# EAGLE design myWatch (EAGLE 6.6.0)

## Sheet 1 of 6: MCU
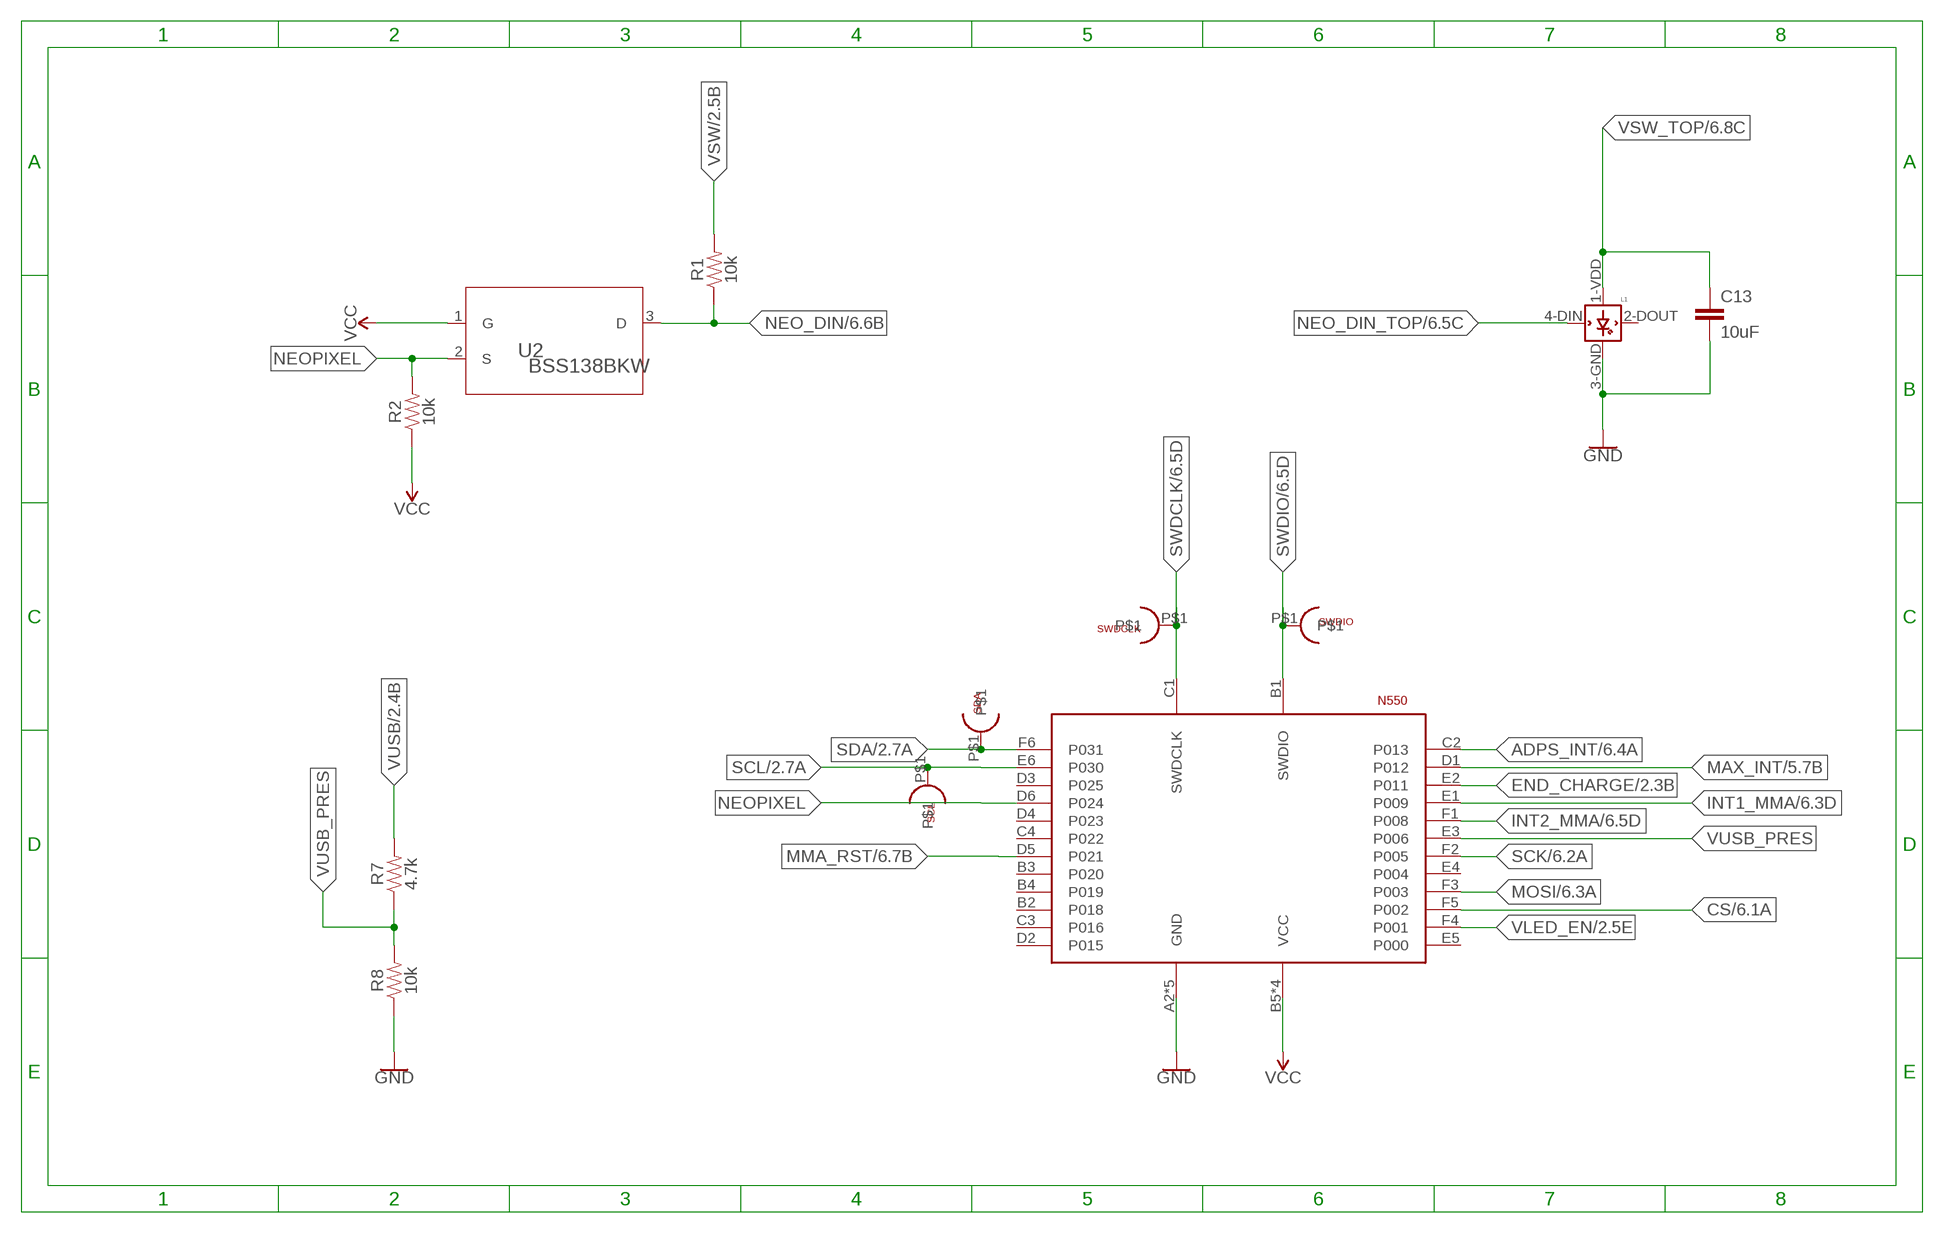
[diagram p0: schematic, sheet 1]

### Parts
C13  10uF  9.0PF-0603-50V-10%  [0603]
L1  WS2812B  [WS2812B]
R1  10k  0.05OHM-0603-1/5W-1%  [0603]
R2  10k  0.05OHM-0603-1/5W-1%  [0603]
R7  4.7k  0.05OHM-0603-1/5W-1%  [0603]
R8  10k  0.05OHM-0603-1/5W-1%  [0603]
SCL  SCL  TESTPOINT  [TESTPOINT]
SDA  SDA  TESTPOINT  [TESTPOINT]
SWDCLK  TESTPOINT  [TESTPOINT]
SWDIO  TESTPOINT  [TESTPOINT]
U2  BSS138BKW  [SOT65P210X110-3N]
U$1  N5150  [N5150]

### Nets
ADPS_INT: U$1.C2(P013) ; also sheet 6
CS: U$1.F5(P002) ; also sheet 6
END_CHARGE: U$1.E2(P011) ; also sheet 2
GND [pwr]: C13.2 L1.3-GND(GND) R8.1 U$1.A2(GND) U$1.A3(GND) U$1.A4(GND) U$1.A5(GND) U$1.A6(GND) ; also sheet 2,3,4,5,6
INT1_MMA: U$1.E1(P009) ; also sheet 6
INT2_MMA: U$1.F1(P008) ; also sheet 6
MAX_INT: U$1.D1(P012) ; also sheet 5
MMA_RST: U$1.D5(P021) ; also sheet 6
MOSI: U$1.F3(P003) ; also sheet 6
NEO_DIN: R1.1 U2.3(D) ; also sheet 6
NEO_DIN_TOP: L1.4-DIN(DIN) ; also sheet 6
NEOPIXEL: R2.2 U2.2(S) U$1.D6(P024)
SCK: U$1.F2(P005) ; also sheet 6
SCL: SCL.P$1 U$1.E6(P030) ; also sheet 2,5,6
SDA: SDA.P$1 U$1.F6(P031) ; also sheet 2,5,6
SWDCLK: SWDCLK.P$1 U$1.C1(SWDCLK) ; also sheet 6
SWDIO: SWDIO.P$1 U$1.B1(SWDIO) ; also sheet 6
VCC [pwr]: R2.1 U2.1(G) U$1.B5(VCC) U$1.B6(VCC) U$1.C5(VCC) U$1.C6(VCC) ; also sheet 2,3,4,5,6
VLED_EN: U$1.F4(P001) ; also sheet 2
VSW [pwr]: R1.2 ; also sheet 2,5,6
VSW_TOP [charge]: C13.1 L1.1-VDD(VDD) ; also sheet 6
VUSB [charge]: R7.2 ; also sheet 2
VUSB_PRES: R7.1 R8.2 U$1.E3(P006)
Unconnected: L1.2-DOUT(DOUT) U$1.B2(P018) U$1.B3(P020) U$1.B4(P019) U$1.C3(P016) U$1.C4(P022) U$1.D2(P015) U$1.D3(P025) U$1.D4(P023) U$1.E4(P004) U$1.E5(P000)

## Sheet 2 of 6: Power
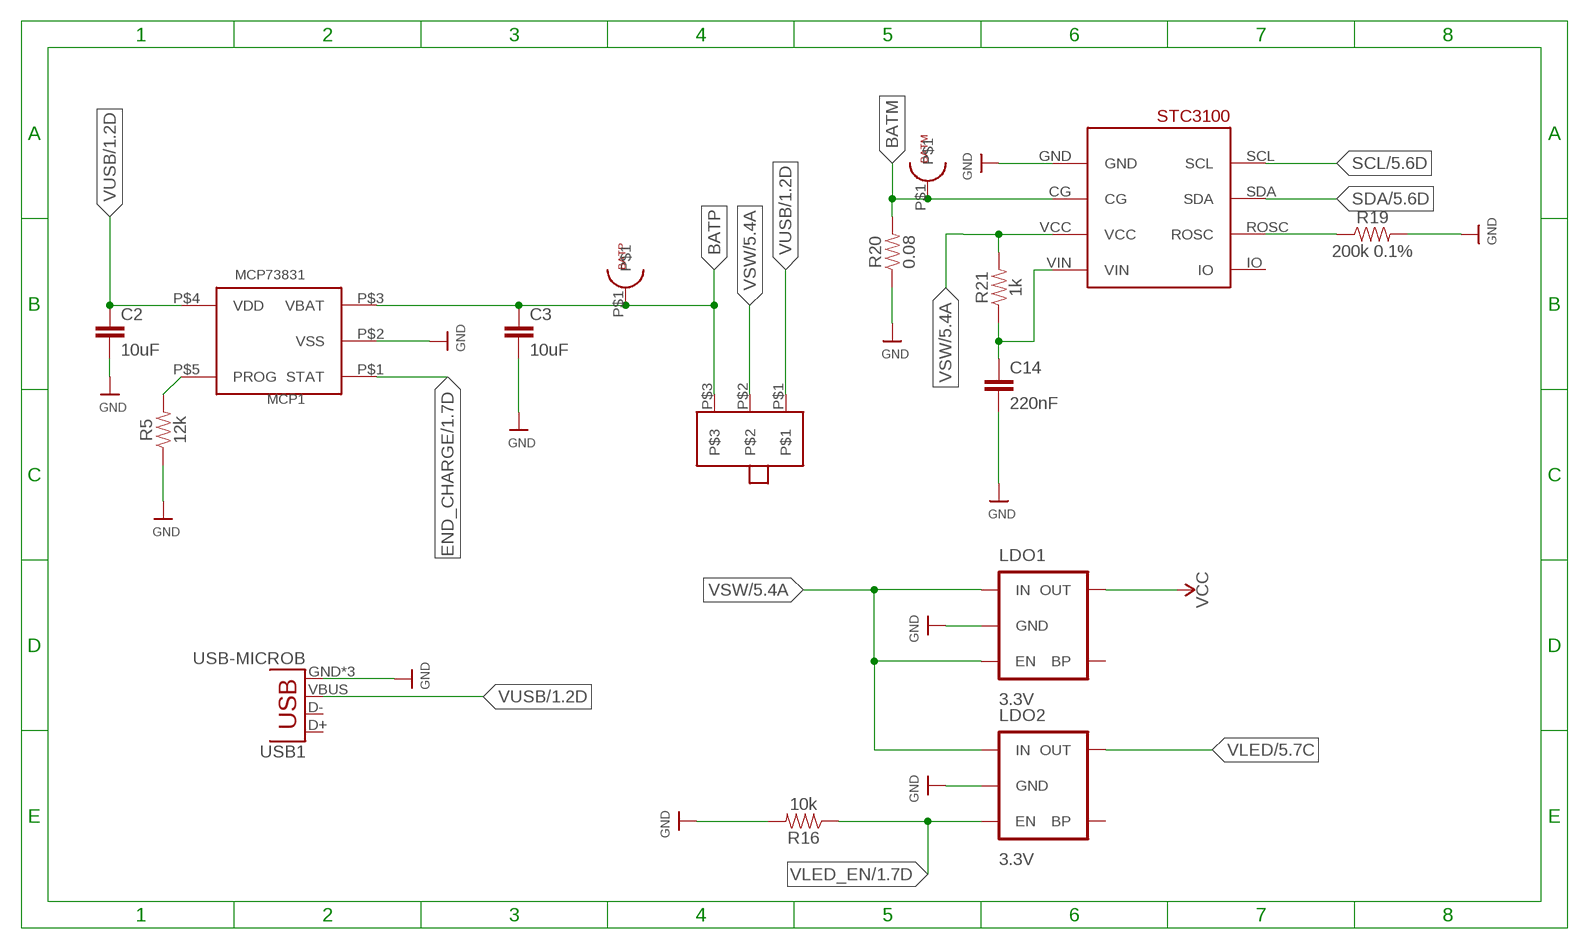
[diagram p1: schematic, sheet 2]

### Parts
BATM  BATM  TESTPOINT  [TESTPOINT]
BATP  BATP  TESTPOINT  [TESTPOINT]
C2  10uF  1.0PF-0603-50V-25%  [0603]
C3  10uF  1.0PF-0603-50V-25%  [0603]
C14  220nF  1.0PF-0603-50V-25%  [0603]
LDO1  3.3V  V_REG_MIC52053.3V  [SOT23-5]
LDO2  3.3V  V_REG_MIC52053.3V  [SOT23-5]
MCP1  MCP73831  [5PIN_SOT23]
R5  12k  0.05OHM-0603-1/5W-1%  [0603]
R16  10k  0.05OHM-0603-1/5W-1%  [0603]
R19  200k 0.1%  0.05OHM-0603-1/5W-1%  [0603]
R20  0.08  0.05OHM-0603-1/5W-1%  [0603]
R21  1k  0.05OHM-0603-1/5W-1%  [0603]
STC1  STC3100  [STC3100]
U$10  JS102011SAQN  [JS102011SAQN]
USB1  USB-MICROB  [USB-MICROB]

### Nets
BATM [charge]: BATM.P$1 R20.2 STC1.CG
BATP [charge]: BATP.P$1 C3.1 MCP1.P$3(VBAT) U$10.P$3
END_CHARGE: MCP1.P$1(STAT) ; also sheet 1
GND [pwr]: C2.2 C3.2 C14.2 LDO1.2(GND) LDO2.2(GND) MCP1.P$2(VSS) R5.1 R16.2 R19.2 R20.1 STC1.GND USB1.GND USB1.MT1(GND) USB1.MT2(GND) ; also sheet 1,3,4,5,6
N$1: MCP1.P$5(PROG) R5.2
N$11: R19.1 STC1.ROSC
N$13: C14.1 R21.1 STC1.VIN
SCL: STC1.SCL ; also sheet 1,5,6
SDA: STC1.SDA ; also sheet 1,5,6
VCC [pwr]: LDO1.5(OUT) ; also sheet 1,3,4,5,6
VLED [pwr]: LDO2.5(OUT) ; also sheet 5,6
VLED_EN: LDO2.3(EN) R16.1 ; also sheet 1
VSW [pwr]: LDO1.1(IN) LDO1.3(EN) LDO2.1(IN) R21.2 STC1.VCC U$10.P$2 ; also sheet 1,5,6
VUSB [charge]: C2.1 MCP1.P$4(VDD) U$10.P$1 USB1.VBUS ; also sheet 1
Unconnected: LDO1.4(BP) LDO2.4(BP) STC1.IO USB1.D+ USB1.D-

## Sheet 3 of 6: Acc
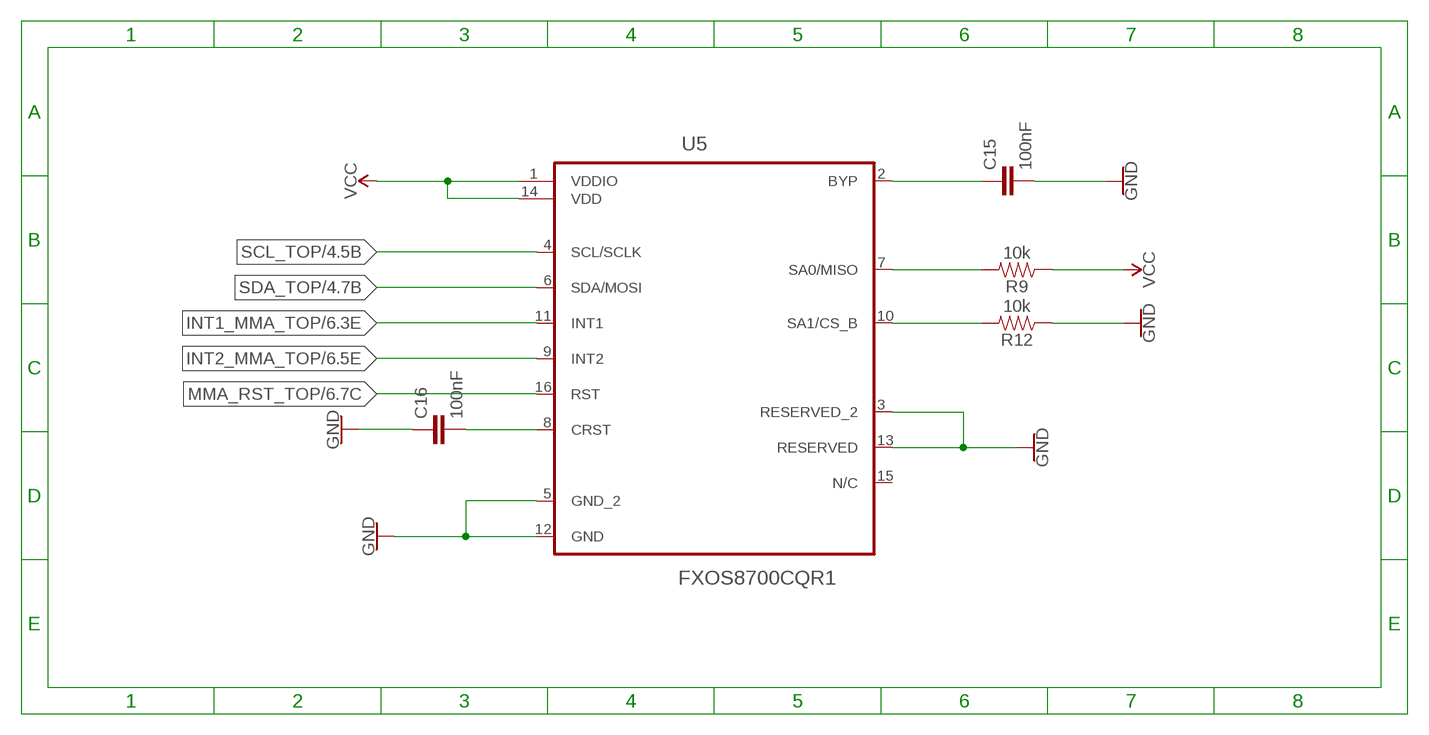
[diagram p2: schematic, sheet 3]

### Parts
C15  100nF  1.0PF-0603-50V-25%  [0603]
C16  100nF  1.0PF-0603-50V-25%  [0603]
R9  10k  0.27OHM-0603-1/10W-1%  [0603]
R12  10k  0.27OHM-0603-1/10W-1%  [0603]
U5  FXOS8700CQR1  [QFN50P300X300X120-16N]

### Nets
GND [pwr]: C15.2 C16.1 R12.1 U5.3(RESERVED_2) U5.5(GND_2) U5.12(GND) U5.13(RESERVED) ; also sheet 1,2,4,5,6
INT1_MMA_TOP: U5.11(INT1) ; also sheet 6
INT2_MMA_TOP: U5.9(INT2) ; also sheet 6
MMA_RST_TOP: U5.16(RST) ; also sheet 6
N$2: C16.2 U5.8(CRST)
N$4: R12.2 U5.10(SA1/CS_B)
N$7: R9.2 U5.7(SA0/MISO)
N$8: C15.1 U5.2(BYP)
SCL_TOP: U5.4(SCL/SCLK) ; also sheet 4,6
SDA_TOP: U5.6(SDA/MOSI) ; also sheet 4,6
VCC [pwr]: R9.1 U5.1(VDDIO) U5.14(VDD) ; also sheet 1,2,4,5,6
Unconnected: U5.15(N/C)

## Sheet 4 of 6: Periph
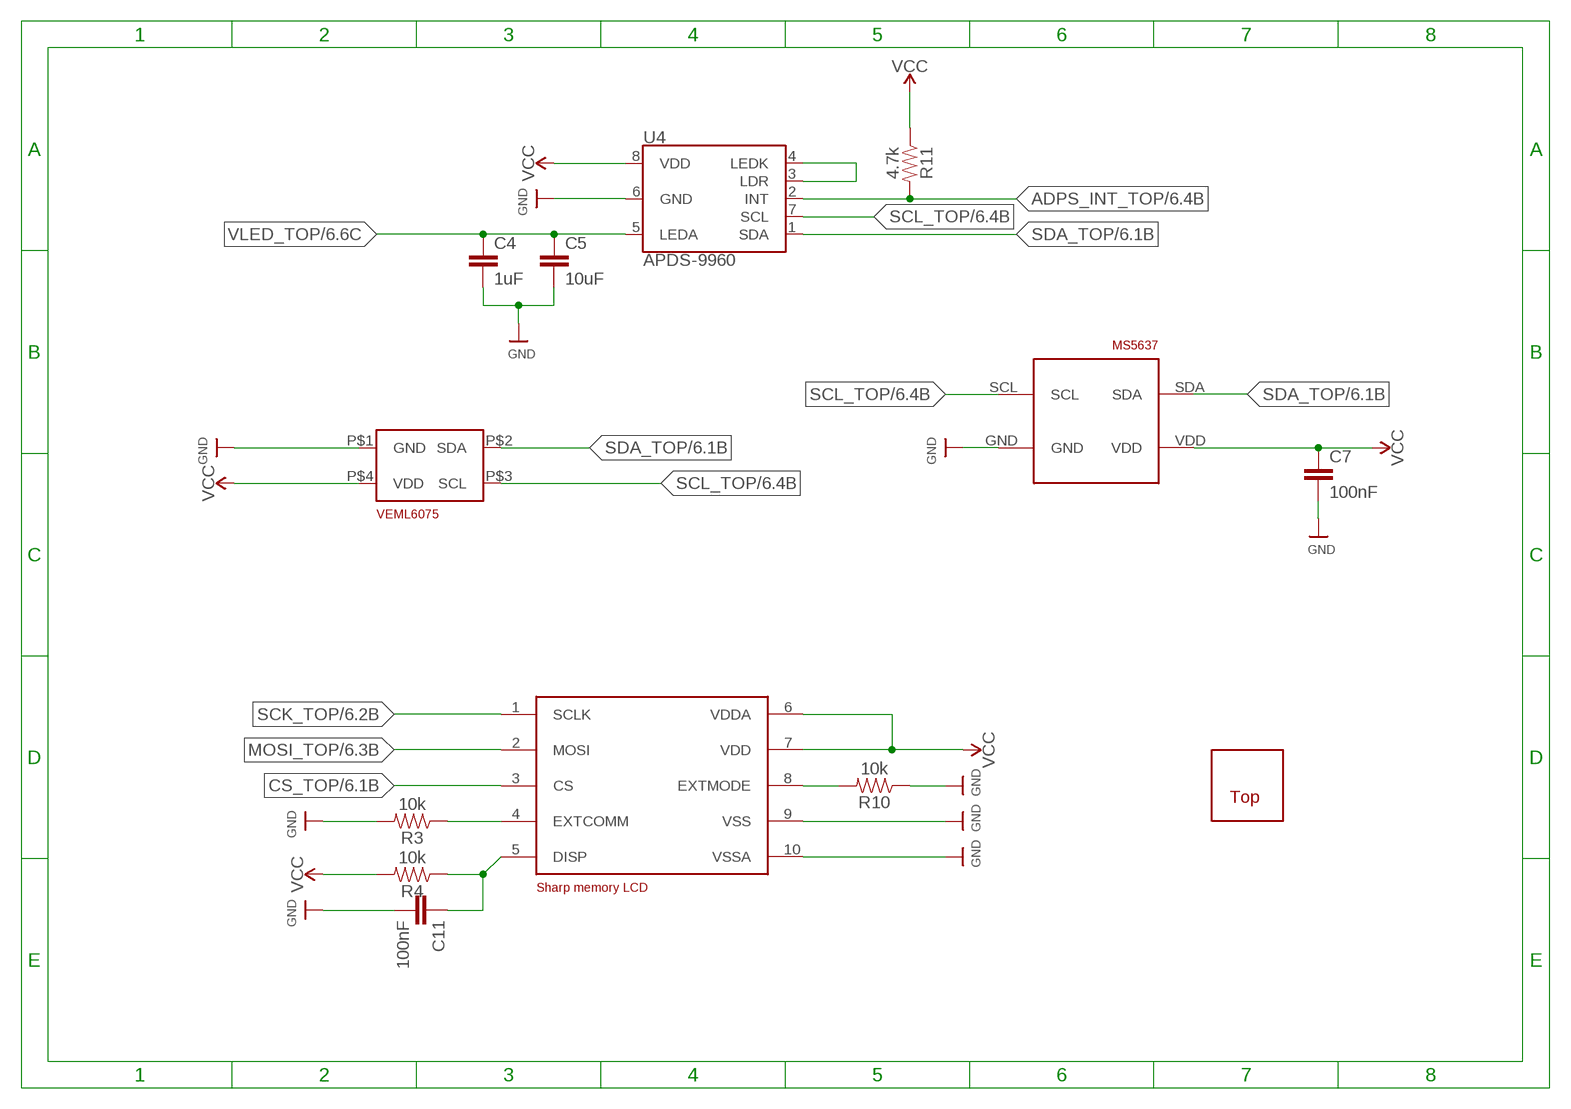
[diagram p3: schematic, sheet 4]

### Parts
C4  1uF  1.0PF-0603-50V-25%  [0603]
C5  10uF  1.0PF-0603-50V-25%  [0603]
C7  100nF  1.5PF-0603-50V-16.667%  [0603]
C11  100nF  1.5PF-0603-50V-16.667%  [0603]
MS5637  MS5637  [MS5637]
R3  10k  0.05OHM-0603-1/5W-1%  [0603]
R4  10k  0.05OHM-0603-1/5W-1%  [0603]
R10  10k  0.05OHM-0603-1/5W-1%  [0603]
R11  4.7k  0.05OHM-0603-1/5W-1%  [0603]
SHARP  SHARP27  [SHARP27]
U4  APDS-9960  [APDS-9960]
U$2  VEML6075  [VEML6075]
U$6  WATCH1  [WATCH]

### Nets
ADPS_INT_TOP: R11.2 U4.2(INT) ; also sheet 6
CS_TOP: SHARP.3(CS) ; also sheet 6
GND [pwr]: C4.2 C5.2 C7.2 C11.2 MS5637.GND R3.2 R10.1 SHARP.9(VSS) SHARP.10(VSSA) U4.6(GND) U$2.P$1(GND) ; also sheet 1,2,3,5,6
MOSI_TOP: SHARP.2(MOSI) ; also sheet 6
N$3: U4.3(LDR) U4.4(LEDK)
N$25: R10.2 SHARP.8(EXTMODE)
N$26: R3.1 SHARP.4(EXTCOMM)
N$27: C11.1 R4.1 SHARP.5(DISP)
SCK_TOP: SHARP.1(SCLK) ; also sheet 6
SCL_TOP: MS5637.SCL U4.7(SCL) U$2.P$3(SCL) ; also sheet 3,6
SDA_TOP: MS5637.SDA U4.1(SDA) U$2.P$2(SDA) ; also sheet 3,6
VCC [pwr]: C7.1 MS5637.VDD R4.2 R11.1 SHARP.6(VDDA) SHARP.7(VDD) U4.8(VDD) U$2.P$4(VDD) ; also sheet 1,2,3,5,6
VLED_TOP: C4.1 C5.1 U4.5(LEDA) ; also sheet 6

## Sheet 5 of 6: MAX30102
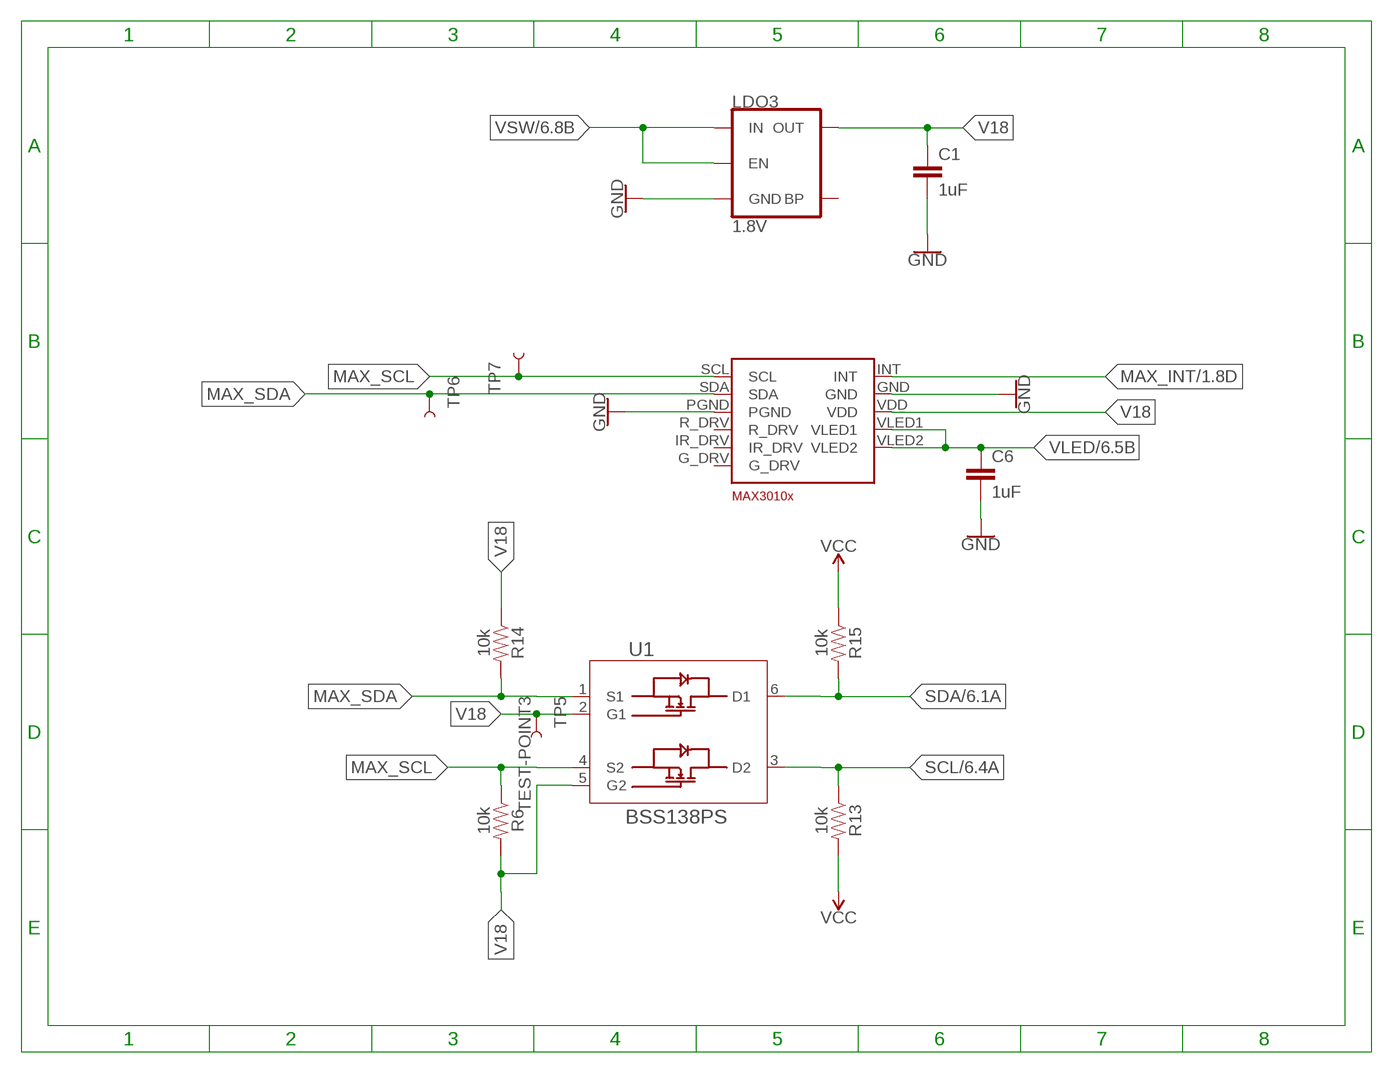
[diagram p4: schematic, sheet 5]

### Parts
C1  1uF  5.6PF-0603-50V-5%  [0603]
C6  1uF  5.6PF-0603-50V-5%  [0603]
LDO3  1.8V  V_REG_MIC5205ADJ  [SOT23-5]
R6  10k  1.2MOHM-0603-1/10W-1%  [0603]
R13  10k  1.2MOHM-0603-1/10W-1%  [0603]
R14  10k  1.2MOHM-0603-1/10W-1%  [0603]
R15  10k  1.2MOHM-0603-1/10W-1%  [0603]
TP5  TEST-POINT3  [PAD.03X.03]
TP6  TEST-POINT3  [PAD.03X.03]
TP7  TEST-POINT3  [PAD.03X.03]
U1  BSS138PS  [SOT65P210X110-6N]
U3  MAX30102  [MAX30102]

### Nets
GND [pwr]: C1.2 C6.2 LDO3.2(GND) U3.GND U3.PGND ; also sheet 1,2,3,4,6
MAX_INT: U3.INT ; also sheet 1
MAX_SCL: R6.1 TP7.P$1 U1.4(S2) U3.SCL
MAX_SDA: R14.2 TP6.P$1 U1.1(S1) U3.SDA
SCL: R13.1 U1.3(D2) ; also sheet 1,2,6
SDA: R15.2 U1.6(D1) ; also sheet 1,2,6
V18: C1.1 LDO3.5(OUT) R6.2 R14.1 TP5.P$1 U1.2(G1) U1.5(G2) U3.VDD
VCC [pwr]: R13.2 R15.1 ; also sheet 1,2,3,4,6
VLED [pwr]: C6.1 U3.VLED1 U3.VLED2 ; also sheet 2,6
VSW [pwr]: LDO3.1(IN) LDO3.3(EN) ; also sheet 1,2,6
Unconnected: LDO3.4(BP) U3.G_DRV U3.IR_DRV U3.R_DRV

## Sheet 6 of 6: Connectors
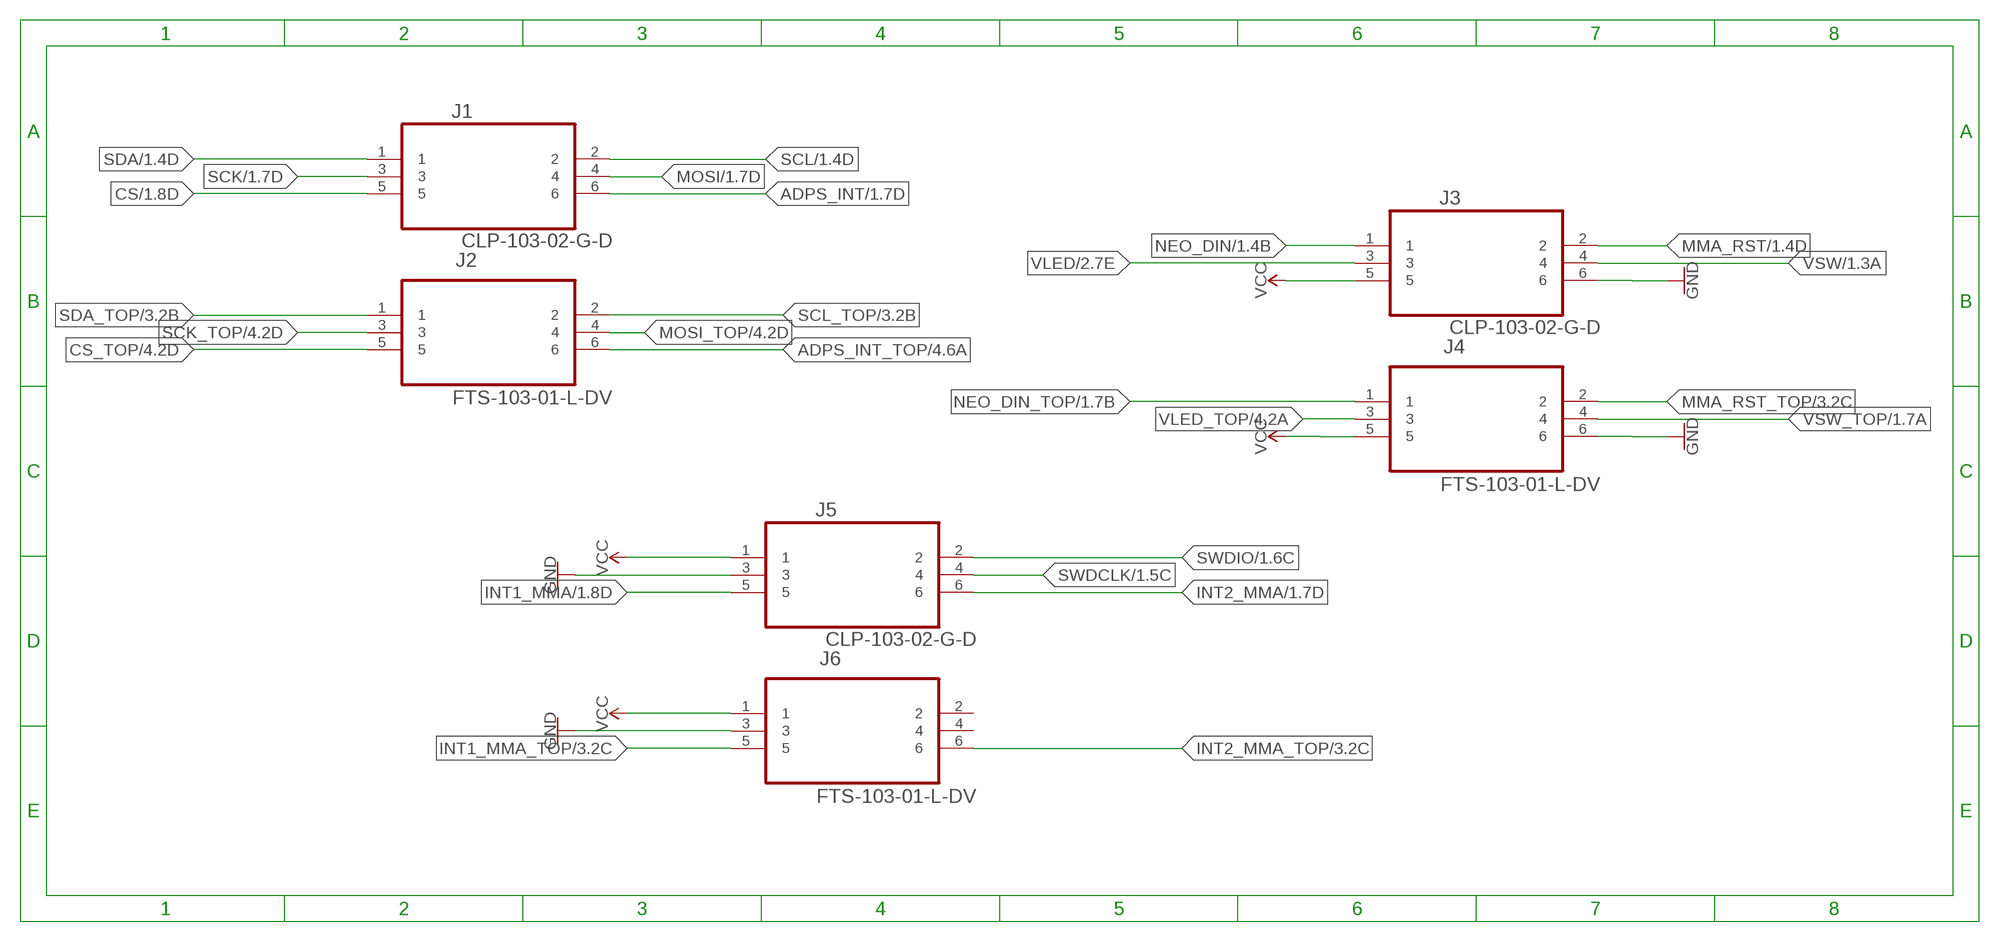
[diagram p5: schematic, sheet 6]

### Parts
J1  CLP-103-02-G-D  [SAMTEC_CLP-103-02-G-D]
J2  FTS-103-01-L-DV  [SAMTEC_FTS-103-01-L-DV]
J3  CLP-103-02-G-D  [SAMTEC_CLP-103-02-G-D]
J4  FTS-103-01-L-DV  [SAMTEC_FTS-103-01-L-DV]
J5  CLP-103-02-G-D  [SAMTEC_CLP-103-02-G-D]
J6  FTS-103-01-L-DV  [SAMTEC_FTS-103-01-L-DV]

### Nets
ADPS_INT: J1.6 ; also sheet 1
ADPS_INT_TOP: J2.6 ; also sheet 4
CS: J1.5 ; also sheet 1
CS_TOP: J2.5 ; also sheet 4
GND [pwr]: J3.6 J4.6 J5.3 J6.3 ; also sheet 1,2,3,4,5
INT1_MMA: J5.5 ; also sheet 1
INT1_MMA_TOP: J6.5 ; also sheet 3
INT2_MMA: J5.6 ; also sheet 1
INT2_MMA_TOP: J6.6 ; also sheet 3
MMA_RST: J3.2 ; also sheet 1
MMA_RST_TOP: J4.2 ; also sheet 3
MOSI: J1.4 ; also sheet 1
MOSI_TOP: J2.4 ; also sheet 4
NEO_DIN: J3.1 ; also sheet 1
NEO_DIN_TOP: J4.1 ; also sheet 1
SCK: J1.3 ; also sheet 1
SCK_TOP: J2.3 ; also sheet 4
SCL: J1.2 ; also sheet 1,2,5
SCL_TOP: J2.2 ; also sheet 3,4
SDA: J1.1 ; also sheet 1,2,5
SDA_TOP: J2.1 ; also sheet 3,4
SWDCLK: J5.4 ; also sheet 1
SWDIO: J5.2 ; also sheet 1
VCC [pwr]: J3.5 J4.5 J5.1 J6.1 ; also sheet 1,2,3,4,5
VLED [pwr]: J3.3 ; also sheet 2,5
VLED_TOP: J4.3 ; also sheet 4
VSW [pwr]: J3.4 ; also sheet 1,2,5
VSW_TOP [charge]: J4.4 ; also sheet 1
Unconnected: J6.2 J6.4

## Library data of the parts
BATM BATP SCL SDA SWDCLK SWDIO = test_points:TESTPOINT
C1 C6 = SparkFun-Capacitors:5.6PF: 5.6pF ceramic capacitors A capacitor is a passive two-terminal electrical component used to store electrical energy temporarily in an electric field.; PROD_ID: CAP-12456; VALUE: 5.6PF
C2-C5 C14-C16 = SparkFun-Capacitors:1.0PF: 1pF ceramic capacitors A capacitor is a passive two-terminal electrical component used to store electrical energy temporarily in an electric field.; PROD_ID: CAP-07879; VALUE: 1.0pF
C7 C11 = SparkFun-Capacitors:1.5PF: 1.5pF ceramic capacitors A capacitor is a passive two-terminal electrical component used to store electrical energy temporarily in an electric field.; PROD_ID: CAP-08763; VALUE: 1.5pF
C13 = SparkFun-Capacitors:9.0PF: 9.0pF ceramic capacitors A capacitor is a passive two-terminal electrical component used to store electrical energy temporarily in an electric field.; PROD_ID: CAP-09341; VALUE: 9.0pF
J1 J3 J5 = Conn_CAC:CLP-103-02-G-D: SOCKET, 1.27MM, VERTICAL THT, 6WAY; MPN: CLP-103-02-G-D; OC_FARNELL: 1929038; OC_NEWARK: 11P3802; PACKAGE: 1.27MM, VERTICAL THT, 6WAY; SUPPLIER: SAMTEC
J2 J4 J6 = Conn_CAC:FTS-103-01-L-DV; DESCRIPTION: Through Hole Post Header; MPN: FTS-103-01-L-DV; OC_FARNELL: 1928409; OC_NEWARK: 11P4645; PACKAGE: 6 WAY header; SUPPLIER: SAMTEC
L1 = adafruit:WS2812B
LDO1 LDO2 = SparkFun-PowerIC:V_REG_MIC5205: V_REG MIC5219 Standard 3.3V and 5V 150mA LDO voltage regulator in SOT-23 layout. Micrel part MIC5205. BP (by-pass) pin is used to lower output noise with 470pF cap, may be left open.; PROD_ID: VREG-00822; VALUE: 3.3V/150mA
LDO3 = SparkFun-IC-Power:V_REG_MIC5205: V_REG MIC5205 Standard 3.3V, 5V, and Adjustable 150mA LDO voltage regulator in SOT-23 layout. Micrel part MIC5205. BP (by-pass) pin is used to lower output noise with 470pF cap, may be left open. On the adjustable version BP is used to set output.; PROD_ID: VREG-12594; VALUE: ADJ
MCP1 = BaseApp:MCP73831: Digikey No:- __MCP73831T-2ACI/OTCT-ND__
MS5637 = MS5637:MS5637: Le MS563702BA03-50 est un Micro Altimètre ultra compact optimisé pour des applications d'altimètre et de baromètre dans des téléphones portables et des tablettes. La résolution d'altitude au niveau de la mer est de 13cm d'air. Le module de capteur comprend un capteur de pression haute linéarité et un CAN ΔΣ 24 bits ultra faible puissance avec des coefficients internes calibrés en usine. Il fournit une valeur numérique de pression et de température précise de 24 bits et différents modes de fonctionnement qui permettent à l'utilisateur d'optimiser la vitesse de conversion et la consommation de courant. La sortie de température à haute résolution permet la mise en œuvre d'une fonction altimètre / thermomètre sans capteur supplémentaire. Il peut être interfacé avec pratiquement tous les microcontrôleurs à interface I²C-bus. Le protocole de communication est simple, sans avoir à programmer des registres internes dans l'appareil. Faibles dimensions de 3 x 3 x 0.9mm³ pour une intégratio Module haute résolution, 13cm Capteur de pression numérique intégré (CAN ΔΣ 24 bits) Interface I²C Plage de pression étendue de 10 à 2000mbar Conversion rapide jusqu'à 0.5ms Faible consommation, 0.6µA (veille <=0.1µA à 25°C) Aucun composant externe (oscillateur interne)
R1-R5 R7 R8 R10 R11 R16 R19-R21 = SparkFun-Resistors:0.05OHM: 0.05Ω resistor A resistor is a passive two-terminal electrical component that implements electrical resistance as a circuit element. Resistors act to reduce current flow, and, at the same time, act to lower voltage levels within circuits. - Wikipedia; PROD_ID: RES-12535; VALUE: 0.05
R6 R13-R15 = SparkFun-Resistors:1.2MOHM: 1.2MΩ resistor A resistor is a passive two-terminal electrical component that implements electrical resistance as a circuit element. Resistors act to reduce current flow, and, at the same time, act to lower voltage levels within circuits. - Wikipedia; PROD_ID: RES-10055; VALUE: 1.2M
R9 R12 = SparkFun-Resistors:0.27OHM: 0.27Ω resistor A resistor is a passive two-terminal electrical component that implements electrical resistance as a circuit element. Resistors act to reduce current flow, and, at the same time, act to lower voltage levels within circuits. - Wikipedia; PROD_ID: RES-08787; VALUE: 0.27
SHARP = sharp:SHARP27: Sharp memory LCD LS027B7DH01
STC1 = STC3100:STC3100: The STC3100 monitors the critical parameters of a single-cell Li-Ion battery (voltage, temperature and current) and includes hardware functions to implement a gas gauge for battery charge monitoring, based on a programmable 12- to 14-bit A/D converter. With a typical 30 milliOhms external sense resistor, the battery current can be up to 2.5 A and the accumulator system provides a capacity up to +/-7000 mAh with a resolution of 0.2 mAh. The device is programmable through the I2C interface.
TP5-TP7 = SparkFun-Connectors:TEST-POINT: SparkFun Test Points Bare copper test points for troubleshooting or In-Circuit-Testing. These are used by our Production team for verifying production board runs using pogo-pins on test beds. SparkFun Products: SparkFun LSM9DS1 Breakout <https://www.sparkfun.com/products/13284> SparkFun PSOC <https://www.sparkfun.com/products/13714> SparkFun Load Cell Amplifier <https://www.sparkfun.com/products/13879>
U1 = BSS138:BSS138PS: Dual N-channel Trench MOSFET; MPN: BSS138PS; OC_FARNELL: 1972664; OC_NEWARK: 58T9002; PACKAGE: SOT-363-6; SUPPLIER: NXP
U2 = BSS138:BSS138BKW: N-channel Trench MOSFET; MPN: BSS138BKW; OC_FARNELL: 2053836; OC_NEWARK: 61T7488; PACKAGE: SOT-23-3; SUPPLIER: NXP
U3 = MAX30102:MAX30102: High-Sensitivity Pulse Oximeter and Heart-Rate Sensor for Wearable Health
U4 = SparkFun-Sensors:APDS-9960: Avago APDS-9960 Digital Proximity, Ambient Light, RGB, and Gesture Sensor. The APDS-9960 offers ambient light and color measuring, proximity detection, and touchless gesture sensing. It features UV and IR blocking filters, four separate diodes sensitive to different directions, and an I2C compatible interface. Datasheet <https://cdn.sparkfun.com/datasheets/Sensors/Proximity/apds9960.pdf> SparkFun Products SparkFun RGB and Gesture Sensor - APDS-9960 <https://www.sparkfun.com/products/12787> (SEN-12787); PROD_ID: SEN-12005
U5 = FXOS8700CQR1:FXOS8700CQR1: ACCELEROMETER, MEMS, 6-AXIS, DIGITAL OUTPUT,QFN-16; MPN: FXOS8700CQR1; OC_FARNELL: Unknown; OC_NEWARK: 47W8598; PACKAGE: QFN-16; SUPPLIER: FREESCALE SEMICONDUCTOR
U$1 = N5:N5150: Based on Nordic Semiconductor’s nRF51422 SoC, the N5 ANT SoC module series offers support for both ANT® and Bluetooth® low energy and enables both protocols to run concurrently, depending on the loaded protocol stack.
U$2 = VEML6075:VEML6075: The VEML6075 senses UVA and UVB light and incorporates photodiode, amplifiers, and analog / digital circuits into a single chip using a CMOS process. When the UV sensor is applied, it is able to detect UVA and UVB intensity to provide a measure of the signal strength as well as allowing for UVI measurement.
U$6 = myWatch:WATCH1
U$10 = JS102011SAQN:JS102011SAQN: Sub-Miniature Slide Switches
USB1 = SparkFun-Connectors:USB: USB Connectors USB-B-PTH is fully proven SKU : PRT-00139/CONN-08278 USB-miniB is fully proven SKU : PRT-00587 USB-A-PCB is untested. USB-A-H is throughly reviewed, but untested. Spark Fun Electronics SKU : PRT-00437 USB-B-SMT is throughly reviewed, but untested. Needs silkscreen touching up. USB-A-S has not been used/tested USB-MB-H has not been used/tested USB-MICROB has been used. CONN-09505; PROD_ID: CONN-09505

## Net classes
0 default: width 0.203 mm, drill 0.152 mm, clearance 0.152 mm
1 pwr: width 0.254 mm, drill 0.152 mm, clearance 0.152 mm to class 0, clearance 0.152 mm
2 charge: width 0.381 mm, drill 0.152 mm, clearance 0.152 mm to class 0, clearance 0.152 mm to class 1, clearance 0.152 mm
3 usb: width 0.254 mm, drill 0.33 mm, clearance 0.152 mm to class 0, clearance 0.152 mm to class 1, clearance 0.152 mm to class 2, clearance 0.152 mm

## Board
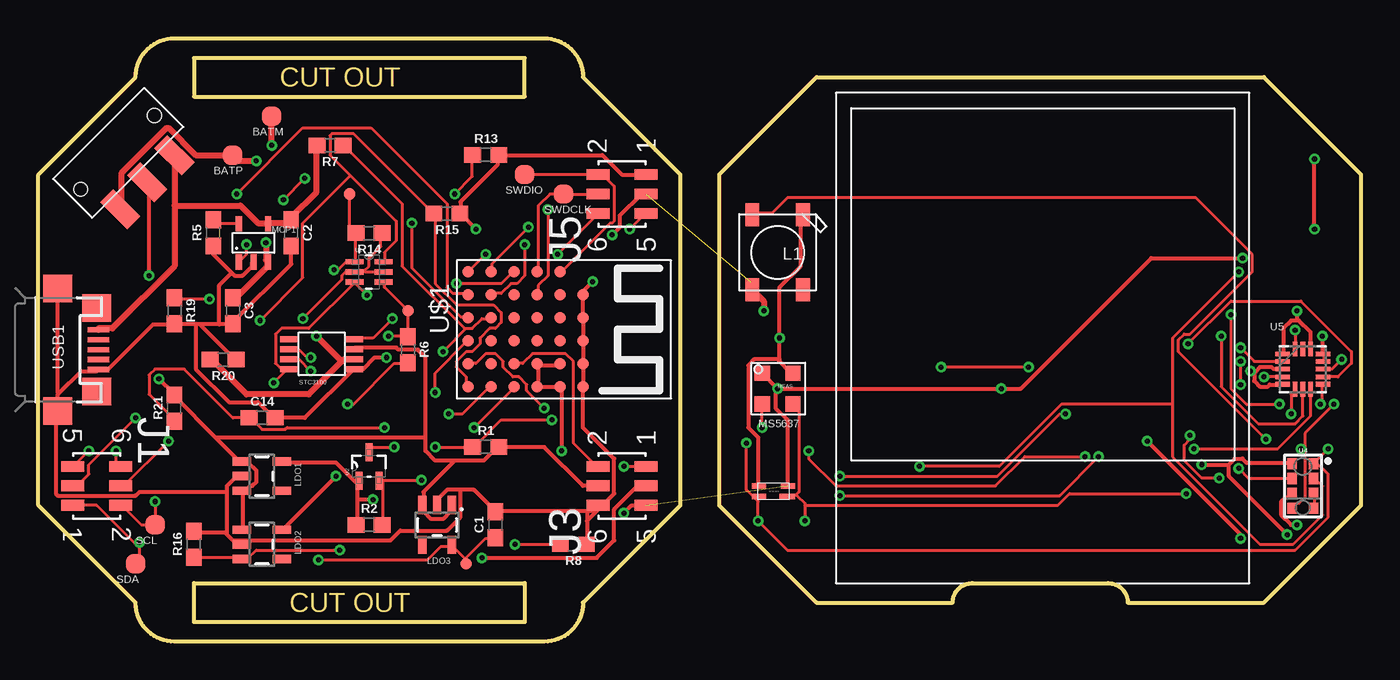
[diagram p6: board, top side]
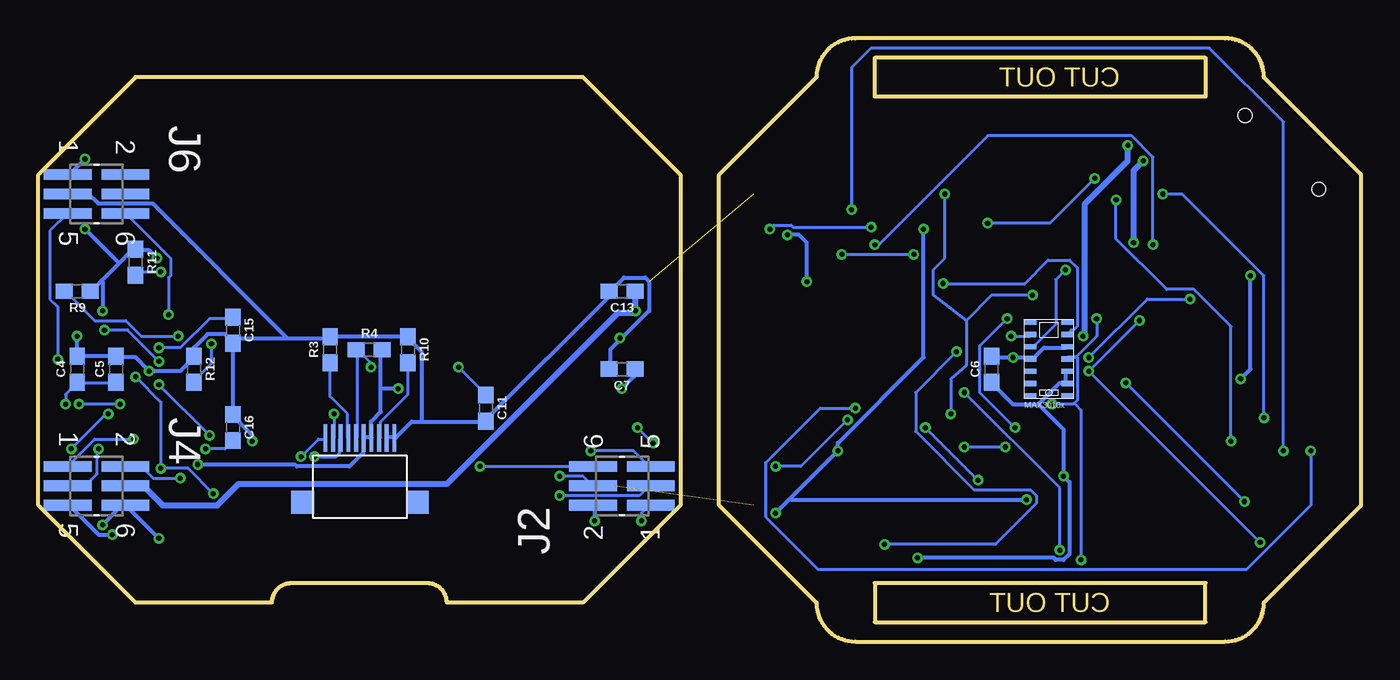
[diagram p7: board, bottom side, seen from below]

Size 86.36 x 39.37 mm. Coordinates in mm from the lower left corner, seen from the top.
Copper layers (1*16): Top 0.0356mm / dielectric 1.5011mm / Bottom 0.0356mm
Design rules "oshpark-2layer *": minimum track width 6mil, minimum drill 13mil, track to track 6mil, track to pad 6mil, pad to pad 6mil, via to via 6mil, smd to smd 6mil, copper to edge 15mil, drill to drill 6mil, minimum pad ring 7mil, minimum via ring 7mil, stop-mask expansion 2.5mil, vias tented up to drill 0mil, thermal gap 10mil

### Footprints (pad centres in the part's own frame; a part is rotated, then mirrored left to right if it is on the bottom)
TESTPOINT = smd 1.27 x 1.27: P$1 0,0
0603 = smd 1.1 x 1: 1 -0.85,0; 2 0.85,0
SAMTEC_CLP-103-02-G-D = smd 0.711 x 1.499: 1 1.27,-1.575; 2 1.27,1.575; 3 0,-1.575; 4 0,1.575; 5 -1.27,-1.575; 6 -1.27,1.575
SAMTEC_FTS-103-01-L-DV = smd 0.711 x 3.124: 1 -1.27,-1.88; 2 -1.27,1.88; 3 0,-1.88; 4 0,1.88; 5 1.27,-1.88; 6 1.27,1.88
WS2812B = smd 1.5 x 0.9: 1-VDD 2.45,-1.65; 2-DOUT 2.45,1.65; 3-GND -2.45,1.65; 4-DIN -2.45,-1.65
SOT23-5 = smd 0.55 x 1.2: 1 -0.95,-1.3; 2 0,-1.3; 3 0.95,-1.3; 4 0.95,1.3; 5 -0.95,1.3
5PIN_SOT23 = smd 0.4 x 1: P$1 0.4,-0.63; P$2 1.35,-0.63; P$3 2.3,-0.63; P$4 2.3,1.87; P$5 0.4,1.87
MS5637 = smd 1 x 1: GND 1,1; SCL 1,-1; SDA -1,-1; VDD -1,1
SHARP27 = smd 1.8 x 0.25: 1 -3.12,-2.21; 2 -3.12,-1.71; 3 -3.12,-1.21; 4 -3.12,-0.71; 5 -3.12,-0.21; 6 -3.12,0.29; 7 -3.12,0.79; 8 -3.12,1.29; 9 -3.12,1.79; 10 -3.12,2.29 | smd 1.5 x 1.5: P$8 1.06,3.79; P$9 1.06,-3.71
STC3100 = smd 1.213 x 0.406: CG 4.1,0.65; GND 4.1,0; IO -0.1,1.95; ROSC -0.1,1.3; SCL -0.1,0; SDA -0.1,0.65; VCC 4.1,1.3; VIN 4.1,1.95
PAD.03X.03 = smd 0.762 x 0.762: P$1 0,0
SOT65P210X110-6N = smd 1.168 x 0.356: 1 -0.94,0.66; 2 -0.94,0; 3 -0.94,-0.66; 4 0.94,-0.66; 5 0.94,0; 6 0.94,0.66
SOT65P210X110-3N = smd 1.168 x 0.457: 1 -0.94,0.66; 2 -0.94,-0.66; 3 0.94,0
MAX30102 = smd 0.75 x 0.35: G_DRV 0,0.8; GND 2.4,4; INT 2.4,4.8; IR_DRV 0,1.6; P$8 0,5.6; P$10 2.4,0.8; P$16 2.4,5.6; PGND 0,3.2; R_DRV 0,2.4; SCL 0,4.8; SDA 0,4; VDD 2.4,3.2; VLED1 2.4,2.4; VLED2 2.4,1.6
APDS-9960 = smd 0.6 x 0.72: 1 0.7,1.455; 2 0.7,0.485; 3 0.7,-0.485; 4 0.7,-1.455; 5 -0.7,-1.455; 6 -0.7,-0.485; 7 -0.7,0.485; 8 -0.7,1.455
QFN50P300X300X120-16N = smd 0.965 x 0.305: 1 -1.321,0.991; 2 -1.321,0.508; 3 -1.321,0; 4 -1.321,-0.508; 5 -1.321,-0.991; 9 1.321,-0.991; 10 1.321,-0.508; 11 1.321,0; 12 1.321,0.508; 13 1.321,0.991 | smd 0.305 x 0.965: 6 -0.508,-1.321; 7 0,-1.321; 8 0.508,-1.321; 14 0.508,1.321; 15 0,1.321; 16 -0.508,1.321
N5150 = smd 0.762 x 0.762 bottom: A2 -1.5,0; A3 -3,0; A4 -4.5,0; A5 -6,0; A6 -7.5,0; B1 0,-1.5; B2 -1.5,-1.5; B3 -3,-1.5; B4 -4.5,-1.5; B5 -6,-1.5; B6 -7.5,-1.5; C1 0,-3; C2 -1.5,-3; C3 -3,-3; C4 -4.5,-3; C5 -6,-3; C6 -7.5,-3; D1 0,-4.5; D2 -1.5,-4.5; D3 -3,-4.5; D4 -4.5,-4.5; D5 -6,-4.5; D6 -7.5,-4.5; E1 0,-6; E2 -1.5,-6; E3 -3,-6; E4 -4.5,-6; E5 -6,-6; E6 -7.5,-6; F1 0,-7.5; F2 -1.5,-7.5; F3 -3,-7.5; F4 -4.5,-7.5; F5 -6,-7.5; F6 -7.5,-7.5
VEML6075 = smd 0.9 x 0.35: P$1 0.05,0; P$2 0.05,-0.7; P$4 1.95,0 | smd 1 x 0.35: P$3 1.9,-0.7
JS102011SAQN = smd 1.2 x 2.5: P$1 0,0; P$2 2.5,0; P$3 5,0 | hole 0.9: -0.9,-2.75; 5.9,-2.75
USB-MICROB = smd 0.35 x 1.4: D+ 0,2.65; D- -0.65,2.65; GND 1.3,2.65; ID 0.65,2.65; VBUS -1.3,2.65 | smd 1.8 x 1.9: MT1 -4,0; MT2 4,0; MT3 -2.73,2.54; MT4 2.73,2.54

### Placement (x,y rotation side)
BATM  15.24,34.29 0 top
BATP  12.7,31.75 0 top
C1  29.84,7.62 90 top
C2  16.51,26.67 270 top
C3  12.7,21.59 270 top
C4  83.82,17.78 90 bottom
C5  81.28,17.78 90 bottom
C6  24.13,17.78 90 bottom
C7  48.26,17.78 180 bottom
C11  57.15,15.24 270 bottom
C13  48.26,22.86 180 bottom
C14  14.61,14.61 0 top
C15  73.66,20.32 270 bottom
C16  73.66,13.97 270 bottom
J1  3.81,10.16 270 top
J2  48.26,10.16 90 bottom
J3  38.1,10.16 90 top
J4  82.55,10.16 270 bottom
J5  38.1,29.21 90 top
J6  82.55,29.21 270 bottom
L1  48.26,25.4 270 top
LDO1  14.61,10.8 270 top
LDO2  14.61,6.35 270 top
LDO3  26.04,7.62 180 top
MCP1  12.7,25.4 0 top
MS5637  48.26,16.51 0 top
R1  29.21,12.7 0 top
R2  21.59,7.62 0 top
R3  67.31,19.05 90 bottom
R4  64.77,19.05 0 bottom
R5  11.43,26.67 90 top
R6  24.13,19.05 270 top
R7  19.05,32.38 180 top
R8  34.92,6.35 180 top
R9  83.82,22.86 180 bottom
R10  62.23,19.05 270 bottom
R11  80.01,24.77 270 bottom
R12  76.2,17.78 270 bottom
R13  29.21,31.75 0 top
R14  21.59,26.67 180 top
R15  26.67,27.94 180 top
R16  10.16,6.35 90 top
R19  8.89,21.59 270 top
R20  12.07,18.41 180 top
R21  8.89,15.24 90 top
SCL  7.62,7.62 0 top
SDA  6.35,5.08 0 top
SHARP  65.41,10.16 270 bottom
STC1  16.51,17.78 0 top
SWDCLK  34.29,29.21 0 top
SWDIO  31.75,30.48 0 top
TP5  27.94,5.08 0 top
TP6  20.32,29.21 0 top
TP7  24.13,21.59 0 top
U1  21.59,24.13 0 top
U2  21.59,11.43 90 top
U3  21.59,15.24 0 bottom
U4  82.55,10.16 0 top
U5  82.55,17.78 0 top
U$1  35.56,24.13 90 bottom
U$2  46.99,10.16 0 top
U$6  50.8,3.81 0 top
U$10  8.89,31.75 225 top
USB1  1.27,19.05 270 top

### Tracks (layer width: path | path; a pad name or v marks a point on that pad's centre or on a via)
ADPS_INT  (via drill 0.33)
  Top 0.203: v33.27,28.19 33.27,23.88 32.64,23.24 32.64,22.73 U$1.C2 | v5.08,12.45 5.08,11.68 5.33,11.43 J1.6
  Bottom 0.203: v33.27,28.19 33.27,37.46 32,38.73 9.91,38.73 5.08,33.91 v5.08,12.45
ADPS_INT_TOP  (via drill 0.33)
  Top 0.203: 74.04,15.49 74.04,19.81 v78.36,24.13 | 74.04,15.49 74.04,12.07 79.76,6.35 81.91,6.35 83.82,8.25 83.82,10.16 83.44,10.54 83.31,10.54 U4.2 | v57.53,11.43 62.74,11.43 66.8,15.49 74.04,15.49
  Bottom 0.203: v78.36,24.13 79.88,24.13 80.01,24 R11.2 | v57.53,11.43 50.16,11.43 J2.6
BATM  (via drill 0.33)
  Top 0.381: 19.81,18.29 19.94,18.41 20.57,18.41 STC1.CG | 19.81,18.29 17.65,16.13 13.59,16.13 11.3,18.41 R20.2 | v15.24,32.38 BATM.P$1 | v18.16,19.94 19.68,18.41 19.81,18.29
  Bottom 0.381: v15.24,32.38 15.24,31.37 18.03,28.57 18.03,20.07 v18.16,19.94
BATP  (via drill 0.33)
  Top 0.381: C3.1 12.7,22.48 12.95,22.48 14.99,24.51 14.99,24.77 MCP1.P$3 14.86,24.89 v14.86,26.04 | U$10.P$3 5.46,28.32 5.46,30.61 8.38,33.53 8.51,33.53 10.29,31.75 BATP.P$1 12.83,31.62 13.08,31.37 v14.22,31.37
  Bottom 0.381: v14.86,26.04 14.86,30.73 v14.22,31.37
CS  (via drill 0.33)
  Top 0.203: v33.02,15.24 31.88,16.38 31.88,16.76 31.37,17.27 30.99,17.27 30.35,17.91 30.35,18.29 29.84,18.8 29.21,18.8 28.57,18.16 28.07,18.16 U$1.F5 | v3.3,12.45 2.29,11.43 J1.5
  Bottom 0.203: v33.02,15.24 35.31,15.24 38.86,11.68 38.86,8.13 35.43,4.7 7.49,4.7 3.3,8.89 v3.3,12.45
CS_TOP  (via drill 0.33)
  Top 0.203: v68.33,12.07 64.39,12.07 62.48,10.16 52.07,10.16 50.29,11.94 v50.29,12.45
  Bottom 0.203: v68.33,12.07 66.93,12.07 66.67,12.32 66.67,13.21 SHARP.3 | v50.29,12.45 47.5,12.45 46.48,11.43 J2.5
END_CHARGE  (via drill 0.33)
  Top 0.203: v31.75,25.91 31.75,23.88 31.24,23.37 30.86,23.37 30.23,22.73 29.59,22.73 U$1.E2 | v13.59,25.91 13.59,25.27 13.21,24.89 MCP1.P$1
  Bottom 0.203: v31.75,25.91 31.5,25.91 24.38,33.02 14.99,33.02 13.59,31.62 v13.59,25.91
GND  (via drill 0.33)  (1 unrouted)
  Top 0.254: 35.81,8.51 36.07,8.51 36.45,8.89 J3.6 | 35.81,8.51 29.84,8.51 | 29.84,8.51 C1.2 29.84,8.51 | 35.81,8.51 35.81,7.87 | 35.81,7.87 35.81,6.35 R8.1 | 27.56,9.91 28.45,9.91 29.84,8.51 | 27.56,9.91 26.67,9.91 26.04,9.27 26.04,9.02 LDO3.2 | v22.73,18.54 21.97,18.54 21.21,17.78 20.7,17.78 STC1.GND 20.57,17.78 17.4,14.61 15.49,14.61 C14.2 15.37,14.61 14.35,15.62 12.45,15.62 10.29,17.78 10.29,20.7 | 12.64,24.07 11.43,25.27 11.43,25.78 R5.1 | 12.64,24.07 12.83,23.88 13.34,23.88 13.97,24.51 13.97,24.77 MCP1.P$2 | 11.81,20.7 12.7,20.7 C3.2 12.7,20.83 16.51,24.64 16.51,25.78 C2.2 | 11.81,20.7 10.54,20.7 | 10.54,20.7 10.29,20.7 | 10.29,20.7 8.89,20.7 | 8.89,20.7 R19.2 8.89,20.7 | 10.54,20.7 12.83,18.41 R20.1 | 11.81,20.7 11.81,23.24 12.57,24 12.64,24.07 | 12.26,7.05 12.95,6.35 13.21,6.35 LDO2.2 12.83,6.6 22.99,6.6 23.62,7.24 26.67,7.24 27.56,8.13 27.56,9.91 | 12.26,7.05 12.19,7.11 10.16,7.11 R16.2 | 12.32,9.78 12.32,7.11 12.26,7.05 | 12.32,9.78 12.32,10.16 12.95,10.8 13.21,10.8 LDO1.2 | 1.33,16.19 1.27,16.13 1.27,15.11 USB1.MT2 1.27,14.99 1.14,14.86 1.14,9.65 1.27,9.53 6.35,9.53 6.6,9.78 12.32,9.78 | 1.33,16.19 2.79,17.65 3.81,17.65 USB1.GND 3.94,17.78 4.57,17.78 7.49,20.7 8.89,20.7 | USB1.MT1 1.27,22.99 1.27,16.26 1.33,16.19 | 48.32,18.35 49.15,17.53 MS5637.GND | 48.32,18.35 48.26,18.41 46.74,18.41 46.35,18.03 46.35,13.97 46.99,13.34 46.99,10.16 U$2.P$1 | L1.3-GND 49.78,27.81 49.78,24.51 48.39,23.11 v48.39,19.81 48.39,18.41 48.32,18.35 | v82.17,7.62 81.79,7.62 81.15,8.25 81.15,9.14 81.41,9.4 81.53,9.4 81.79,9.65 U4.6 | U5.12 83.95,18.29 83.95,18.67 U5.13 83.82,18.8 v83.82,19.94
  Top 0.254: 79.44,17.59 79.76,17.91 80.52,17.91 80.65,17.78 81.15,17.78 U5.3 | 79.44,17.59 79.38,17.53 79.38,17.02 79.76,16.64 80.26,16.64 80.39,16.76 81.15,16.76 U5.5 | v79.12,17.65 79.38,17.65 79.44,17.59 | v78.49,6.73 78.49,6.99 v72.39,13.08 | 35.81,7.87 37.59,9.65 37.59,11.94 35.56,13.97 35.56,16.51 U$1.A6 35.56,18.03 U$1.A5 35.56,18.16 35.56,19.56 U$1.A4 35.56,19.68 35.56,21.08 U$1.A3 35.56,21.21 35.56,22.61 U$1.A2 35.56,22.73 35.56,22.86 v36.2,23.49 | v37.47,26.54 37.97,27.05 37.97,27.81 39.37,29.21 39.62,29.21 J5.3
  Bottom 0.254: 21.59,18.54 v22.73,18.54 24.13,18.54 C6.2 | 21.59,18.54 U3.PGND 21.59,18.54 | 21.59,18.54 21.34,18.54 20.7,19.18 19.3,19.18 U3.GND | 48.32,19.75 46.48,21.59 46.48,23.49 46.74,23.75 48.13,23.75 49.02,22.86 C13.2 49.15,22.86 49.15,22.48 57.15,14.48 C11.2 57.15,14.35 61.34,14.35 | 48.32,19.75 49.02,19.05 49.02,17.78 C7.2 | 61.34,14.35 61.98,14.35 62.99,13.34 SHARP.10 63.12,13.34 63.5,13.34 SHARP.9 | v48.39,19.81 48.32,19.75 | v82.17,7.62 80.9,8.89 80.77,8.89 J4.6 80.65,8.89 v78.49,6.73 | 83.82,18.67 81.28,18.67 C5.2 81.28,18.54 80.01,18.54 v79.12,17.65 77.09,17.65 76.2,18.54 R12.1 76.2,18.67 76.2,19.18 75.31,20.07 74.17,20.07 73.66,19.56 C15.2 | 83.82,18.67 C4.2 83.82,18.67 | 83.82,18.67 v83.82,19.94 | C15.2 73.66,19.43 73.66,14.86 C16.1 73.66,14.73 72.39,13.46 v72.39,13.08 | 70.1,19.81 73.79,19.81 C15.2 | 70.1,19.81 67.31,19.81 R3.2 67.31,19.94 62.23,19.94 R10.1 62.23,19.81 61.34,18.92 61.34,14.35 | 70.1,19.81 78.87,28.57 82.42,28.57 83.06,29.21 84.33,29.21 J6.3 | v37.47,26.54 36.7,26.54 36.2,26.04 v36.2,23.49
INT1_MMA  (via drill 0.33)
  Top 0.203: v32,27.05 29.59,24.64 29.59,24.13 U$1.E1 | v38.61,26.92 39.62,27.94 J5.5
  Bottom 0.203: v32,27.05 37.08,27.05 37.21,27.18 38.35,27.18 v38.61,26.92
INT1_MMA_TOP  (via drill 0.33)
  Top 0.203: v85.09,18.41 84.45,17.78 83.95,17.78 U5.11
  Bottom 0.203: v85.09,18.41 85.09,21.84 85.6,22.35 85.6,26.8 84.45,27.94 J6.5
INT2_MMA  (via drill 0.33)
  Top 0.203: v29.21,25.27 U$1.F1 | v33.91,25.27 36.58,27.94 J5.6
  Bottom 0.203: v33.91,25.27 v29.21,25.27
INT2_MMA_TOP  (via drill 0.33)
  Top 0.203: v83.69,15.49 83.82,15.62 83.82,16.76 U5.9 | v81.03,15.49 78.87,15.49 77.85,16.51 v77.85,21.34
  Bottom 0.203: v81.03,15.49 v83.69,15.49 | v77.85,21.34 77.85,23.75 77.72,23.88 77.72,25.02 80.65,27.94 J6.6
MAX_INT  (via drill 0.33)
  Top 0.203: v27.3,23.37 30.23,23.37 30.99,24.13 U$1.D1
  Bottom 0.203: v27.3,23.37 21.97,23.37 20.45,24.89 19.05,24.89 18.54,24.38 18.54,20.57 18.8,20.32 18.92,20.32 19.18,20.07 U3.INT
MAX_SCL  (via drill 0.33)
  Top 0.203: 24.13,19.94 v22.86,19.94 | 24.13,19.94 R6.1 24.13,19.94 | 24.13,19.94 TP7.P$1 22.61,23.11 22.61,23.37 U1.4
  Bottom 0.203: v22.86,19.94 21.59,19.94 U3.SCL
MAX_SDA  (via drill 0.33)
  Top 0.203: TP6.P$1 20.32,27.05 20.7,26.67 | 20.7,26.67 R14.2 20.7,26.67 | v19.3,24.26 19.56,24.26 20.07,24.77 20.57,24.77 U1.1 20.7,24.89 20.7,26.67
  Bottom 0.203: v19.3,24.26 19.94,23.62 19.94,20.7 21.34,19.3 21.59,19.3 U3.SDA
MMA_RST
  Top 0.203: U$1.D5 31.12,18.16 31.62,18.16 32.26,18.8 34.42,18.8 34.92,18.29 34.92,12.95 36.45,11.43 J3.2
MMA_RST_TOP  (via drill 0.33)
  Top 0.203: v82.04,20.32 82.04,19.18 U5.16 | v78.49,16.76 v78.49,18.29 | v75.18,13.46 75.18,13.21 74.8,12.83 74.8,11.81 75.95,10.67 v77.09,10.67
  Bottom 0.203: v82.04,20.32 80.52,20.32 v78.49,18.29 | v75.18,13.46 v78.49,16.76 | v77.09,10.67 78.87,10.67 79.63,11.43 80.65,11.43 J4.2
MOSI  (via drill 0.33)
  Top 0.203: v24.38,27.3 24.38,24.38 27.56,21.21 27.94,21.21 U$1.F3 | v16,28.83 v17.4,30.23 | v8.51,13.08 5.59,10.16 5.46,10.16 J1.4
  Bottom 0.203: v24.38,27.3 20.32,27.3 v17.4,30.23 | v16,28.83 16,26.29 12.7,22.99 10.92,22.99 8.51,20.57 v8.51,13.08
MOSI_TOP  (via drill 0.33)
  Top 0.203: v67.06,14.86 66.67,14.86 62.61,10.8 v52.32,10.8
  Bottom 0.203: v67.06,14.86 67.06,13.34 SHARP.2 | v52.32,10.8 50.8,10.8 50.16,10.16 J2.4
N$1
  Top 0.203: MCP1.P$5 13.08,27.3 11.56,27.3 11.43,27.43 R5.2
N$2  (via drill 0.33)
  Top 0.203: v75.44,12.57 80.9,12.57 83.06,14.73 83.06,16.38 U5.8
  Bottom 0.203: v75.44,12.57 74.17,12.57 73.66,13.08 C16.2
N$3
  Top 0.203: U4.4 83.31,8.76 83.31,9.65 U4.3
N$4  (via drill 0.33)
  Top 0.203: v75.06,19.43 77.85,22.22 82.42,22.22 85.72,18.92 85.72,18.16 84.84,17.27 83.95,17.27 U5.10
  Bottom 0.203: v75.06,19.43 75.06,18.16 76.2,17.02 R12.2
N$7  (via drill 0.33)
  Top 0.203: v77.22,19.94 77.22,16.64 79.63,14.22 82.04,14.22 82.55,14.73 82.55,16.38 U5.7
  Bottom 0.203: v77.22,19.94 79.63,19.94 80.65,20.95 82.68,20.95 84.58,22.86 R9.2
N$8  (via drill 0.33)
  Top 0.203: v78.49,19.18 79.38,18.29 81.15,18.29 U5.2
  Bottom 0.203: v78.49,19.18 77.09,19.18 75.18,21.08 73.66,21.08 C15.1
N$11  (via drill 0.33)
  Top 0.203: v11.18,22.35 8.89,22.35 R19.1 | v17.78,18.54 17.53,18.54 17.02,19.05 16.51,19.05 STC1.ROSC
  Bottom 0.203: v11.18,22.35 13.97,22.35 v17.78,18.54
N$13  (via drill 0.33)
  Top 0.203: R21.1 8.89,14.48 7.24,16.13 7.24,17.4 7.62,17.78 9.52,17.78 12.7,14.61 13.72,14.61 C14.1 13.84,14.61 14.61,13.84 16.13,13.84 16.26,13.97 v22.61,13.97 | v23.11,21.08 21.84,19.81 20.7,19.81 STC1.VIN
  Bottom 0.203: v23.11,21.08 24.89,19.3 24.89,16.26 v22.61,13.97
N$25
  Bottom 0.203: R10.2 62.23,18.16 62.23,16.13 64.01,14.35 64.01,13.34 SHARP.8
N$26
  Bottom 0.203: R3.1 67.31,18.16 67.31,16 66.17,14.86 66.17,13.34 SHARP.4
N$27  (via drill 0.33)
  Top 0.203: v64.64,17.91 v58.93,17.91
  Bottom 0.203: v58.93,17.91 57.15,16.13 C11.1 | v64.64,17.91 64.64,18.16 65.53,19.05 R4.1 65.53,18.92 65.53,13.34 SHARP.5
NEO_DIN  (via drill 0.33)
  Top 0.203: v25.91,12.7 28.32,12.7 R1.1 28.45,12.7 30.23,14.48 v33.53,14.48 | v23.24,12.7 21.84,12.7 21.59,12.45 U2.3 | v38.23,11.43 39.62,11.43 J3.1
  Bottom 0.203: v23.24,12.7 v25.91,12.7 | v38.23,11.43 36.58,11.43 v33.53,14.48
NEO_DIN_TOP  (via drill 0.33)
  Top 0.203: v80.14,13.21 74.42,18.92 74.42,19.68 74.8,20.07 75.18,20.07 79.25,24.13 79.25,25.27 75.56,28.96 48.89,28.96 47.88,27.94 46.74,27.94 L1.4-DIN
  Bottom 0.203: v80.14,13.21 82.68,13.21 84.45,11.43 J4.1
NEOPIXEL  (via drill 0.33)
  Top 0.203: v28.45,13.97 30.99,16.51 U$1.D6 | 22.48,10.54 22.35,10.54 U2.2 | 22.48,10.54 v25.02,10.54 | 22.48,10.54 22.48,7.62 R2.2
  Bottom 0.203: v25.02,10.54 v28.45,13.97
SCK  (via drill 0.33)
  Top 0.203: v12.95,29.21 17.27,33.53 21.72,33.53 26.67,28.57 26.67,23.11 27.05,22.73 27.94,22.73 U$1.F2 | v6.35,14.61 3.3,11.56 3.3,10.92 2.54,10.16 2.29,10.16 J1.3
  Bottom 0.203: v12.95,29.21 11.68,29.21 6.35,23.88 v6.35,14.61
SCK_TOP  (via drill 0.33)
  Top 0.203: v69.22,12.07 66.67,9.53 v52.32,9.53
  Bottom 0.203: v69.22,12.07 68.07,13.21 67.69,13.21 SHARP.1 | v52.32,9.53 47.12,9.53 46.48,10.16 J2.3
SCL  (via drill 0.33)
  Top 0.203: J1.2 5.46,8.89 6.73,7.62 SCL.P$1 v7.62,9.14 | v26.8,14.86 27.69,14.86 29.46,16.64 U$1.E6 | v21.46,22.61 20.7,23.37 U1.3 20.57,23.37 17.65,20.45 15.88,20.45 15.49,20.07 15.49,18.16 15.88,17.78 16.26,17.78 | v27.18,29.21 28.32,30.35 28.32,31.75 R13.1 | 16.26,17.78 16.38,17.78 STC1.SCL 16.26,17.78 | 16.26,17.78 v15.37,16.89
  Bottom 0.203: 25.78,20.95 24.13,22.61 v21.46,22.61 | 25.78,20.95 25.78,18.03 26.8,17.14 v26.8,14.86 | v27.18,29.21 27.18,25.02 27.94,24.26 27.94,22.61 25.78,20.95 | v15.37,16.89 v7.62,9.14
SCL_TOP  (via drill 0.33)
  Top 0.203: v78.36,11.3 78.99,10.67 81.79,10.67 U4.7 | v80.01,17.27 81.15,17.27 U5.4 | 49.47,9.59 49.66,9.78 49.66,15.11 49.28,15.49 MS5637.SCL | 49.47,9.59 49.4,9.53 48.89,9.53 U$2.P$3 | 50.04,8.89 50.04,9.02 49.53,9.53 49.47,9.59 | 50.04,8.89 v50.04,7.87 | v74.93,9.65 67.31,9.65 66.55,8.89 50.04,8.89
  Bottom 0.203: v80.01,17.27 78.36,15.62 v78.36,11.3 76.58,11.3 v74.93,9.65 | v50.04,7.87 50.04,8.89 J2.2
SDA  (via drill 0.33)
  Top 0.203: U$1.F6 27.94,16.64 27.94,17.27 27.3,17.91 27.3,18.29 27.94,18.92 28.32,18.92 28.83,19.43 28.83,19.81 29.46,20.45 29.84,20.45 30.23,20.83 30.23,21.46 29.72,21.97 27.3,21.97 25.91,23.37 25.91,27.94 R15.2 25.78,27.94 20.57,33.15 19.18,33.15 19.05,33.02 19.05,31.75 20.38,30.42 | 20.38,30.42 23.37,27.43 23.37,26.16 22.61,25.4 22.61,24.89 U1.6 | v17.78,17.65 17.02,18.41 16.51,18.41 STC1.SDA | 6.6,6.1 6.6,5.33 SDA.P$1 | 6.6,6.1 v6.6,6.48 | 6.6,6.1 3.81,8.89 2.29,8.89 J1.1 | v14.48,20.95 17.27,23.75 17.27,27.3 20.32,30.35 20.38,30.42
  Bottom 0.203: v6.6,6.48 v17.78,17.65 v14.48,20.95
SDA_TOP  (via drill 0.33)
  Top 0.203: v84.2,12.57 83.31,11.68 U4.1 83.44,11.68 84.2,10.92 84.2,8.13 82.04,5.97 48.89,5.97 v46.99,7.87 46.99,9.14 | v81.79,14.86 81.79,16.13 82.04,16.38 U5.6 | 46.99,9.14 46.99,9.4 U$2.P$2 | v47.24,13.97 47.24,15.49 MS5637.SDA | v46.23,12.95 46.23,9.91 46.99,9.14
  Bottom 0.203: v84.2,12.57 81.91,14.86 v81.79,14.86 | v46.99,7.87 46.99,8.38 46.48,8.89 J2.1 | v46.23,12.95 v47.24,13.97
SWDCLK
  Top 0.203: U$1.C1 32.64,24.13 32.64,28.45 33.4,29.21 SWDCLK.P$1 36.45,29.21 J5.4
SWDIO
  Top 0.203: U$1.B1 34.16,24.13 37.34,27.3 37.47,27.3 37.59,27.43 37.59,29.72 36.83,30.48 36.58,30.48 J5.2 36.45,30.48 SWDIO.P$1
V18  (via drill 0.33)
  Top 0.203: TP5.P$1 27.94,5.33 27.88,5.4 | 27.88,5.4 27.05,6.22 LDO3.5 26.92,6.22 26.29,6.22 25.4,5.33 v18.29,5.33 | C1.1 29.84,6.73 29.21,6.73 27.94,5.46 27.88,5.4 | v17.27,21.08 19.81,23.62 19.81,23.88 20.07,24.13 20.57,24.13 U1.2 20.7,24.13 21.21,24.13 21.27,24.19 | v20.19,15.49 20.57,15.49 23.24,18.16 24.13,18.16 R6.2 | 21.27,24.19 21.59,24.51 21.59,25.02 22.35,25.78 22.35,26.67 R14.1 | U1.5 22.48,24.13 21.34,24.13 21.27,24.19
  Bottom 0.203: 18.61,18.61 17.27,19.94 v17.27,21.08 | 18.61,18.61 18.67,18.54 19.18,18.54 U3.VDD | v20.19,15.49 18.8,15.49 18.73,15.56 | 18.73,15.56 18.54,15.75 18.54,18.54 18.61,18.61 | v18.29,5.33 18.29,15.11 18.67,15.49 18.73,15.56
VCC  (via drill 0.33)  (1 unrouted)
  Top 0.254: 27.56,27.94 27.56,28.7 29.97,31.11 29.97,31.75 R13.2 30.1,31.75 36.83,31.75 38.1,30.48 39.62,30.48 J5.1 | 27.56,27.94 R15.1 27.56,27.94 | 20.83,10.41 20.83,9.27 | 20.83,9.27 20.83,7.62 R2.1 | 20.83,10.41 U2.1 | LDO1.5 16,11.68 19.43,11.68 20.7,10.41 20.83,10.41 | U$1.B5 34.04,18.03 32.77,18.03 U$1.C5 32.64,18.03 32.64,16.64 U$1.C6 32.77,16.64 34.04,16.64 U$1.B6 34.16,16.51 v34.16,12.45 | v38.23,8.38 38.73,8.89 39.62,8.89 J3.5 | v21.84,9.27 20.83,9.27 | v28.57,26.92 27.56,27.94 | 82.17,20.95 82.3,20.95 83.06,20.19 83.06,19.18 U5.14 | 82.17,20.95 81.79,20.95 81.28,20.45 81.28,18.8 U5.1 | v82.17,21.59 82.17,20.95 | v83.31,26.92 v83.31,31.5 | 77.72,11.56 78.1,11.94 78.61,11.94 78.87,11.68 81.79,11.68 U4.8 | 77.72,11.56 77.72,10.8 v81.53,6.99 | 48.13,16.51 48.13,16.64 47.37,17.4 MS5637.VDD | 48.13,16.51 48.13,15.24 48.89,14.48 48.89,10.16 U$2.P$4 | 48.13,16.51 v48.26,16.51 v62.86,16.51 64.13,16.51 72.64,25.02 v78.61,25.02 | v75.95,11.56 77.72,11.56
  Bottom 0.254: 37.27,9.34 v34.16,12.45 34.16,12.95 28.57,18.54 v28.57,26.92 | 37.27,9.34 v38.23,8.38 | v21.84,9.27 37.21,9.27 37.27,9.34 | 80.01,25.53 80.26,25.53 81.09,24.7 | 82.23,23.56 82.93,22.86 R9.1 | 82.23,23.56 81.09,24.7 | 80.01,25.53 R11.1 80.01,25.53 | v82.17,21.59 82.17,23.49 82.23,23.56 | v83.31,31.5 84.33,30.48 J6.1 | v83.31,26.92 81.15,24.77 81.09,24.7 | v81.53,6.99 82.42,6.99 84.33,8.89 J4.5 | 64.01,16.51 64.01,14.99 64.64,14.35 64.64,13.34 | 64.01,16.51 64.01,19.05 R4.2 | 64.64,13.34 SHARP.7 | 64.64,13.34 64.77,13.34 65.02,13.34 SHARP.6 65.15,13.21 65.15,12.32 66.04,11.43 69.47,11.43 69.6,11.56 v75.95,11.56 | v48.26,16.51 47.5,17.27 47.5,17.78 C7.1 | v62.86,16.51 64.01,16.51 | 80.01,25.53 79.12,25.53 v78.61,25.02
VLED  (via drill 0.33)
  Top 0.254: v19.43,10.8 16,7.37 LDO2.5 | v28.96,5.46 36.45,5.46 37.59,6.6 37.59,8.64 39.12,10.16 39.62,10.16 J3.3
  Bottom 0.254: U3.VLED1 19.3,17.53 19.3,16.89 U3.VLED2 19.43,16.89 19.68,16.89 21.08,15.49 | 21.08,15.49 22.73,15.49 24.13,16.89 C6.1 | 21.08,15.49 19.43,13.84 v19.43,10.8 19.05,10.41 19.05,5.71 19.43,5.33 19.94,5.33 20.07,5.46 v28.96,5.46
VLED_EN  (via drill 0.33)
  Top 0.203: v25.91,16.26 25.91,17.53 27.94,19.56 U$1.F4 | v19.68,5.97 14.22,5.97 13.72,5.46 13.34,5.46 LDO2.3 13.21,5.46 10.16,5.46 R16.1
  Bottom 0.203: v25.91,16.26 19.68,10.03 v19.68,5.97
VLED_TOP  (via drill 0.33)
  Top 0.203: 82.68,12.57 82.68,13.59 v84.58,15.49 | 82.68,12.57 82.68,9.4 82.3,9.02 82.17,9.02 81.91,8.76 U4.5 | 82.68,12.57 v82.42,12.57
  Bottom 0.203: v84.58,15.49 84.58,16.13 83.82,16.89 | 83.82,16.89 C4.1 83.82,16.89 | 83.82,16.89 81.28,16.89 C5.1 | v82.42,12.57 82.55,12.45 82.55,10.92 83.31,10.16 84.33,10.16 J4.3
VSW  (via drill 0.33)
  Top 0.254: LDO3.1 26.92,8.89 26.92,8.51 26.42,8 25.65,8 25.15,8.51 25.15,8.89 LDO3.3 25.15,9.02 25.15,9.78 27.18,11.81 | J3.4 36.45,10.16 35.56,10.16 33.02,12.7 30.1,12.7 R1.2 29.97,12.7 29.08,11.81 27.18,11.81 | 25.27,13.34 25.27,12.45 25.91,11.81 27.18,11.81 | 25.27,13.34 25.27,18.54 24.77,19.05 23.5,19.05 23.37,19.18 20.7,19.18 STC1.VCC | LDO2.1 13.34,7.37 13.34,9.78 LDO1.3 13.46,9.78 13.84,10.16 13.97,10.16 14.22,10.41 14.22,11.18 13.72,11.68 13.34,11.68 LDO1.1 13.21,11.68 11.62,13.27 | 11.62,13.27 8.89,16 R21.2 8.89,16.13 v7.87,17.14 | v7.24,23.88 7.24,29.97 U$10.P$2 | 25.27,13.34 11.68,13.34 11.62,13.27
  Bottom 0.254: v7.24,23.88 7.24,17.78 v7.87,17.14
VSW_TOP  (via drill 0.33)
  Top 0.381: v47.37,21.59 47.37,22.22 46.74,22.86 L1.1-VDD
  Bottom 0.381: C13.1 47.37,22.86 v47.37,21.59 47.5,21.46 48.51,21.46 59.69,10.29 73.28,10.29 74.68,8.89 78.23,8.89 79.5,10.16 80.65,10.16 J4.4
VUSB
  Top 0.381: R7.2 18.16,32.38 18.16,29.34 16.51,27.69 C2.1 16.51,27.43 16.38,27.3 15.11,27.3 MCP1.P$4 14.86,27.3 14.35,27.3 13.21,28.45 9.02,28.45 8.89,28.45 | U$10.P$1 8.89,28.45 | 8.89,28.45 8.89,24.51 4.83,20.45 3.94,20.45 USB1.VBUS
VUSB_PRES  (via drill 0.33)
  Top 0.203: 27.94,20.45 27.81,20.45 23.75,24.51 23.75,28.57 19.94,32.38 R7.1 | 27.94,20.45 28.32,20.45 28.96,21.08 29.46,21.08 U$1.E3 | v31.12,6.35 34.04,6.35 R8.2 | 27.94,20.45 v26.42,18.92
  Bottom 0.203: v31.12,6.35 23.88,6.35 21.21,9.02 21.21,9.53 21.59,9.91 25.27,9.91 29.08,13.72 29.08,16.26 v26.42,18.92